# EAGLE design S2Mn10 (EAGLE 7.5.0)
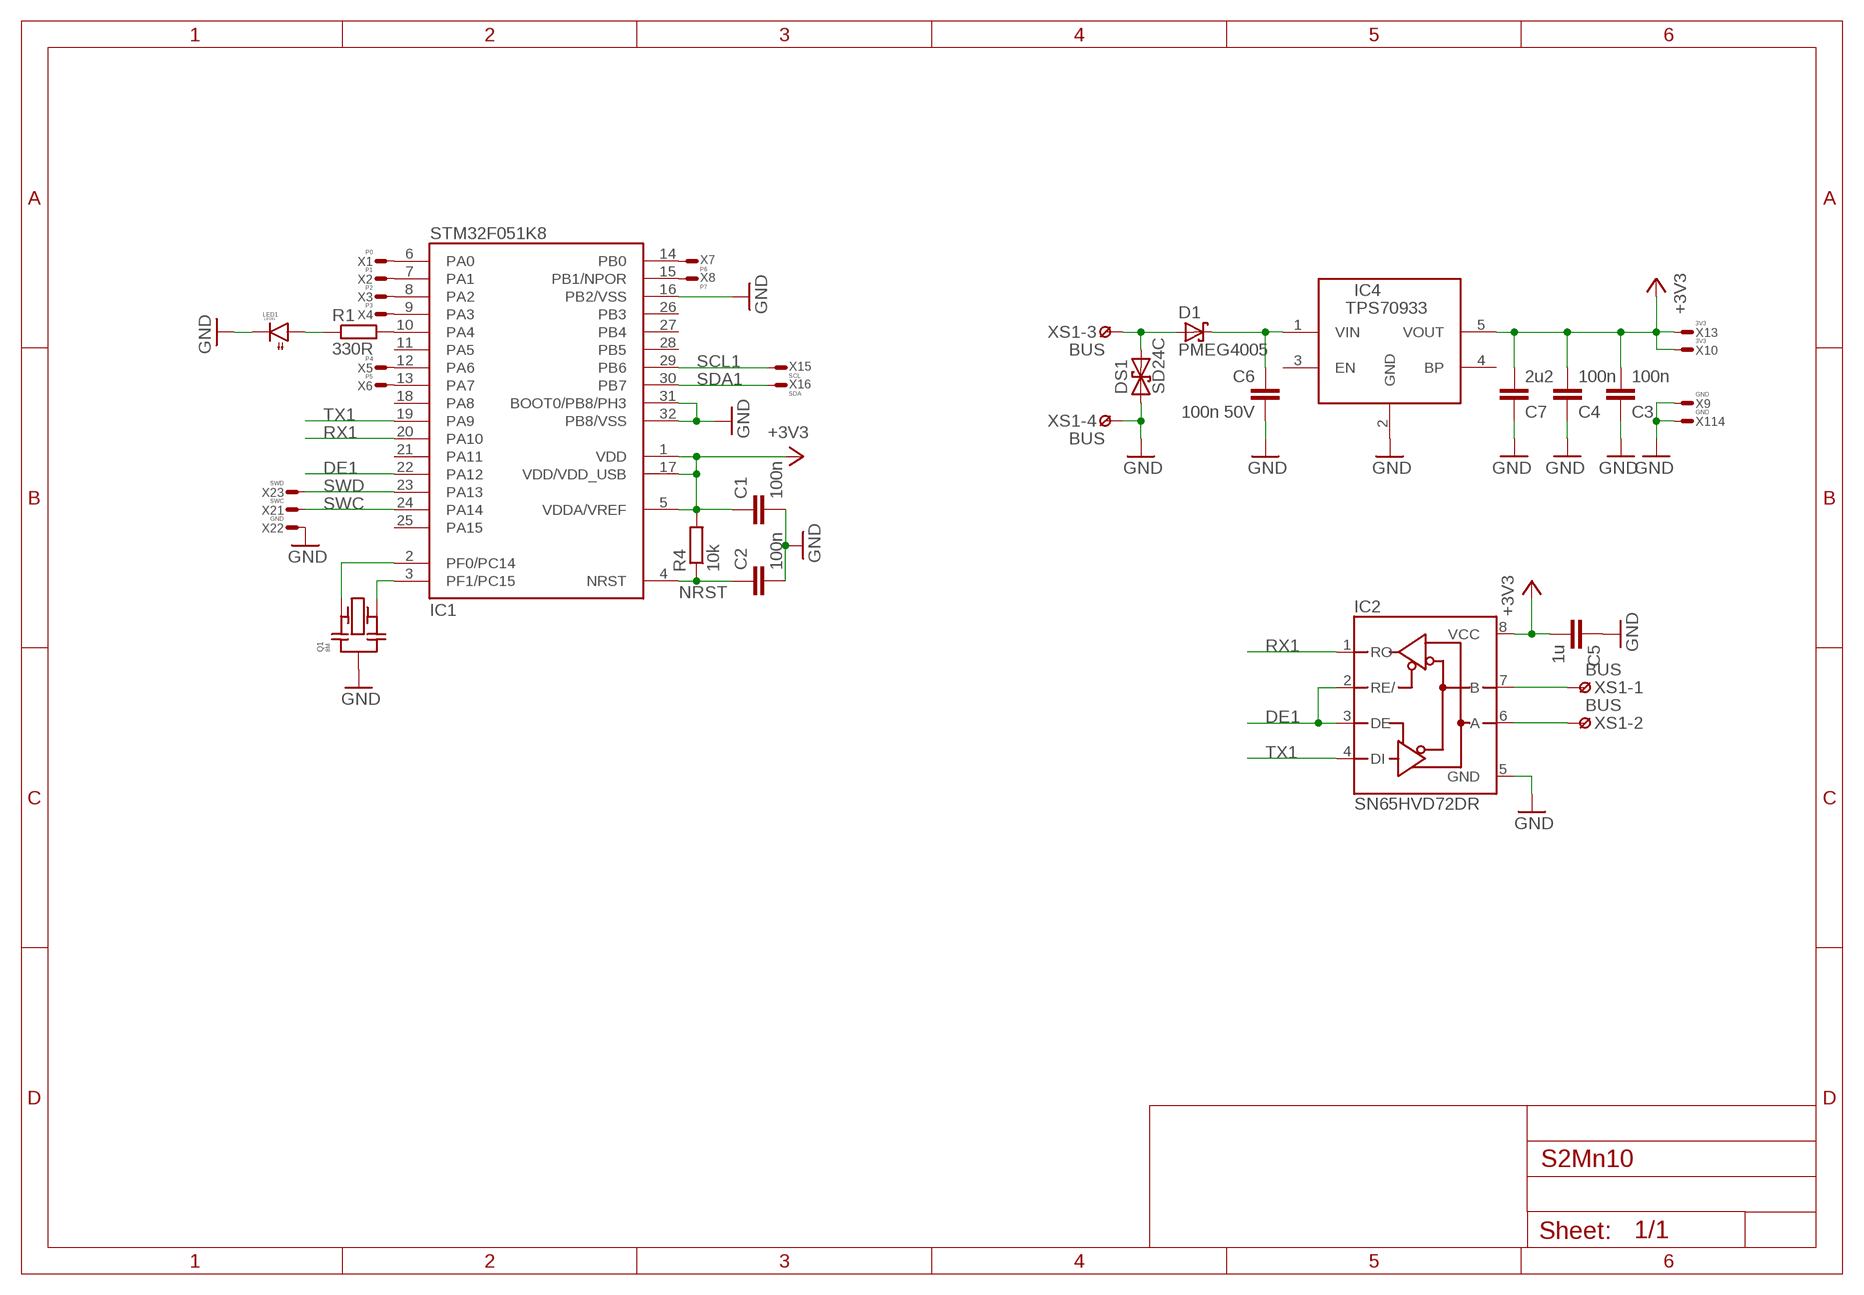
[diagram p0: schematic, sheet 1]

## Parts
C1  100n  C0603  [0603]
C2  100n  C0603  [0603]
C3  100n  C0603  [0603]
C4  100n  C0603  [0603]
C5  1u  C0603  [0603]
C6  100n 50V  C0603  [0603]
C7  2u2  C0603  [0603]
D1  PMEG4005  D-SCHOTKY323  [SOD323]
DS1  SD24C  TVS-U323  [SOD323]
IC1  STM32F051K8  STM32_LQFP32  [LQFP32-7X7]
IC2  SN65HVD72DR  MAX485  [SOIC8]
IC4  TPS70933  LDO  [SOT23-5]
LED1  LEDG  LED1206  [1206]
Q1  8M  QRCE  [CSTCE]
R1  330R  R0603  [0603]
R4  10k  R0603  [0603]
X1  P0  WIREPADT1.6/0.9  [T1.6/0.9]
X2  P1  WIREPADT1.6/0.9  [T1.6/0.9]
X3  P2  WIREPADT1.6/0.9  [T1.6/0.9]
X4  P3  WIREPADT1.6/0.9  [T1.6/0.9]
X5  P4  WIREPADT1.6/0.9  [T1.6/0.9]
X6  P5  WIREPADT1.6/0.9  [T1.6/0.9]
X7  P6  WIREPADT1.6/0.9  [T1.6/0.9]
X8  P7  WIREPADT1.6/0.9  [T1.6/0.9]
X9  GND  WIREPADT1.6/0.9  [T1.6/0.9]
X10  3V3  WIREPADT1.6/0.9  [T1.6/0.9]
X13  3V3  WIREPADT1.6/0.9  [T1.6/0.9]
X15  SCL  WIREPADT1.6/0.9  [T1.6/0.9]
X16  SDA  WIREPADT1.6/0.9  [T1.6/0.9]
X21  SWC  WIREPADT1.6/0.9  [T1.6/0.9]
X22  GND  WIREPADT1.6/0.9  [T1.6/0.9]
X23  SWD  WIREPADT1.6/0.9  [T1.6/0.9]
X114  GND  WIREPADT1.6/0.9  [T1.6/0.9]
XS1  BUS  1725672  [1725672]

## Nets
+3V3: C1.1 C3.2 C4.2 C5.2 C7.2 IC1.1(VDD) IC1.5(VDDA/VREF) IC1.17(VDD/VDD_USB) IC2.8(VCC) IC4.5(VOUT) R4.2 X10.1(S) X13.1(S)
DE1: IC1.22(PA12) IC2.2(RE/) IC2.3(DE)
GND: C1.2 C2.2 C3.1 C4.1 C5.1 C6.2 C7.1 DS1.A IC1.16(PB2/VSS) IC1.31(BOOT0/PB8/PH3) IC1.32(PB8/VSS) IC2.5(GND) IC4.2(GND) LED1.2(C) Q1.G(M) X9.1(S) X22.1(S) X114.1(S) XS1.4
LED: IC1.10(PA4) R1.2
N$1: IC2.6(A) XS1.2
N$2: IC1.3(PF1/PC15) Q1.B
N$3: IC2.7(B) XS1.1
N$4: IC1.6(PA0) X1.1(S)
N$5: IC1.2(PF0/PC14) Q1.A
N$6: IC1.7(PA1) X2.1(S)
N$7: IC1.8(PA2) X3.1(S)
N$8: IC1.9(PA3) X4.1(S)
N$9: IC1.12(PA6) X5.1(S)
N$10: IC1.13(PA7) X6.1(S)
N$11: IC1.14(PB0) X7.1(S)
N$12: IC1.15(PB1/NPOR) X8.1(S)
N$13: D1.A DS1.C XS1.3
N$14: LED1.1(A) R1.1
N$15: C6.1 D1.C IC4.1(VIN)
NRST: C2.1 IC1.4(NRST) R4.1
RX1: IC1.20(PA10) IC2.1(RO)
SCL1: IC1.29(PB6) X15.1(S)
SDA1: IC1.30(PB7) X16.1(S)
SWC: IC1.24(PA14) X21.1(S)
SWD: IC1.23(PA13) X23.1(S)
TX1: IC1.19(PA9) IC2.4(DI)
Unconnected: IC1.11(PA5) IC1.18(PA8) IC1.21(PA11) IC1.25(PA15) IC1.26(PB3) IC1.27(PB4) IC1.28(PB5) IC4.3(EN) IC4.4(BP)

## Library data of the parts
C1-C7 = RCL:C: Capacitor SMD
D1 = Diode:D-SCHOTKY: Schottky Diode
DS1 = Diode:TVS-U: DIODE
IC1 = STM32:STM32_LQFP32
IC2 = ICs:MAX485
IC4 = DCDC:LDO
LED1 = Optic:LED
Q1 = QUARTZ:QR
R1 R4 = RCL:R: Resistor SMD
X1-X10 X13 X15 X16 X21-X23 X114 = Conn:WIREPAD: Wire PAD connect wire on PCB
XS1 = Conn:1725672

## Board
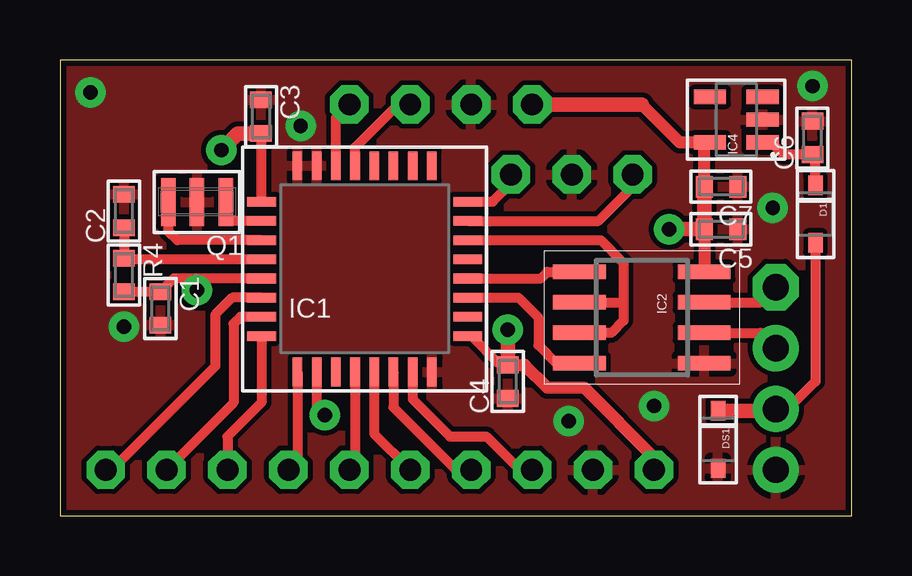
[diagram p1: board, top side]
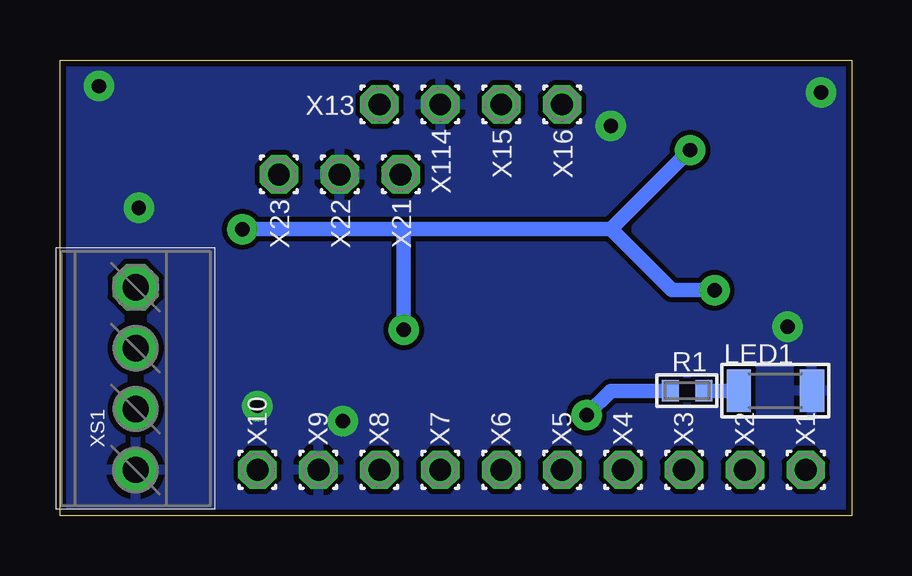
[diagram p2: board, bottom side, seen from below]

Size 33 x 19 mm. Coordinates in mm from the lower left corner, seen from the top.
Outline: 0,0 33,0 33,19 0,19 0,0
Copper layers (1*16): Top 0.035mm / dielectric 1.5mm / Bottom 0.035mm
Design rules "default *": minimum track width 10mil, minimum drill 12mil, track to track 8mil, track to pad 8mil, pad to pad 8mil, via to via 8mil, smd to smd 8mil, copper to edge 10mil, drill to drill 8mil, minimum pad ring 10mil, minimum via ring 8mil, stop-mask expansion 2mil, vias tented up to drill 0mil, thermal gap 10mil

### Footprints (pad centres in the part's own frame; a part is rotated, then mirrored left to right if it is on the bottom)
0603 = smd 0.7 x 0.9: 1 -0.697,0; 2 0.697,0
SOD323 = smd 0.8 x 0.6: A 1.2,0; C -1.2,0
LQFP32-7X7 = smd 1.2 x 0.4: 1 -4.3,2.8; 2 -4.3,2; 3 -4.3,1.2; 4 -4.3,0.4; 5 -4.3,-0.4; 6 -4.3,-1.2; 7 -4.3,-2; 8 -4.3,-2.8; 17 4.3,-2.8; 18 4.3,-2; 19 4.3,-1.2; 20 4.3,-0.4; 21 4.3,0.4; 22 4.3,1.2; 23 4.3,2; 24 4.3,2.8 | smd 0.4 x 1.2: 9 -2.8,-4.3; 10 -2,-4.3; 11 -1.2,-4.3; 12 -0.4,-4.3; 13 0.4,-4.3; 14 1.2,-4.3; 15 2,-4.3; 16 2.8,-4.3; 25 2.8,4.3; 26 2,4.3; 27 1.2,4.3; 28 0.4,4.3; 29 -0.4,4.3; 30 -1.2,4.3; 31 -2,4.3; 32 -2.8,4.3
SOIC8 = smd 0.6 x 2.2: 1 -1.905,-2.6; 2 -0.635,-2.6; 3 0.635,-2.6; 4 1.905,-2.6; 5 1.905,2.6; 6 0.635,2.6; 7 -0.635,2.6; 8 -1.905,2.6
SOT23-5 = smd 0.6 x 1.35: 1 -0.95,-1.101; 2 0,-1.101; 3 0.95,-1.101; 4 0.95,1.101; 5 -0.951,1.101
1206 = smd 1.016 x 1.778: 1 -1.524,0; 2 1.524,0
CSTCE = smd 0.6 x 2: A -1.2,0; B 1.2,0; G 0,0
T1.6/0.9 = drill 0.914 pad 1.6 octagon: 1 0,0
1725672 = drill 1.1 pad 1.93 octagon: 1 -3.81,0 | drill 1.1 pad 1.93: 2 -1.27,0; 3 1.27,0; 4 3.81,0

### Placement (x,y rotation side)
C1  4.19,8.64 270 top
C2  2.67,12.7 90 top
C3  8.38,16.64 270 top
C4  18.67,5.59 90 top
C5  27.56,11.94 180 top
C6  31.37,15.75 90 top
C7  27.56,13.72 180 top
D1  31.5,12.57 270 top
DS1  27.43,3.17 270 top
IC1  12.7,10.29 0 top
IC2  24.26,8.26 270 top
IC4  28.19,16.51 90 top
LED1  3.17,5.21 0 bottom
Q1  5.71,13.08 180 top
R1  6.86,5.21 180 bottom
R4  2.67,10.03 270 top
X1  1.91,1.91 90 bottom
X2  4.45,1.91 90 bottom
X3  6.99,1.91 90 bottom
X4  9.53,1.91 90 bottom
X5  12.06,1.91 90 bottom
X6  14.61,1.91 90 bottom
X7  17.14,1.91 90 bottom
X8  19.68,1.91 90 bottom
X9  22.23,1.91 90 bottom
X10  24.77,1.91 90 bottom
X13  19.68,17.14 180 bottom
X15  14.61,17.14 270 bottom
X16  12.06,17.14 270 bottom
X21  18.8,14.22 270 bottom
X22  21.34,14.22 270 bottom
X23  23.88,14.22 270 bottom
X114  17.14,17.14 270 bottom
XS1  29.84,5.71 270 bottom

### Tracks (layer width: path | path; a pad name or v marks a point on that pad's centre or on a via)
+3V3  (via drill 0.6 pad 1.27)
  Top 0.406: IC1.1 8.4,15.92 C3.2 | IC1.5 5.71,9.89 | 5.71,9.89 4.75,9.89 C1.1 R4.2 | v5.71,9.4 5.71,9.89 | IC1.17 17.15,7.49 18.29,6.35 18.6,6.35 C4.2
  Top 0.508: 24.26,17.14 25.84,15.56 IC4.5 26.86,15.56 C7.2 | C5.2 IC2.8 | C4.2 19.37,6.29 20.32,5.33 21.84,5.33 24.77,2.41
  Top 0.61: v25.4,11.94 C5.2 C7.2 | 8.4,15.92 7.41,15.92 v6.73,15.24 | C4.2 v18.67,7.75 | 24.26,17.14 X13.1 | X10.1 24.77,2.41
  Bottom 0.61: v25.4,11.94 18.67,11.94 | 18.67,11.94 10.03,11.94 | 10.03,11.94 v6.73,15.24 | 10.03,11.94 7.49,9.4 v5.71,9.4 | v18.67,7.75 18.67,11.94
DE1
  Top 0.406: IC2.3 22.99,7.62 23.5,8.13 23.5,8.89 | 23.5,8.89 23.5,10.54 22.55,11.49 IC1.22 | IC2.2 23.5,8.89
GND  (via drill 0.6 pad 1.27)
  other vias: 21.21,3.94 29.72,12.83 24.77,4.57 31.37,17.91 10.03,16.26 2.67,7.87 1.27,17.65
  pour Top: 0,0 33,0 33,19 0,19
  pour Bottom: 0,0 33,0 33,19 0,19
LED  (via drill 0.6 pad 1.27)
  Top 0.406: IC1.10 10.7,4.54 v11.05,4.19
  Bottom 0.61: R1.2 10.03,5.21 v11.05,4.19
N$1
  Top 0.406: IC2.6 29.21,7.62 XS1.2
N$2
  Top 0.406: IC1.3 4.9,11.49 4.51,11.87 Q1.B
N$3
  Top 0.406: IC2.7 29.21,8.89 XS1.1
N$4
  Top 0.406: IC1.6 7.18,9.09 6.48,8.38 6.48,6.22 2.16,1.91 X1.1
N$5
  Top 0.406: IC1.2 6.92,12.29 Q1.A
N$6
  Top 0.406: IC1.7 7.53,8.29 7.24,8 7.24,4.7 X2.1
N$7
  Top 0.406: IC1.8 8.4,4.72 6.99,3.3 X3.1
N$8
  Top 0.406: IC1.9 9.9,2.28 X4.1
N$9
  Top 0.406: IC1.12 12.3,2.14 X5.1
N$10
  Top 0.406: IC1.13 13.1,3.41 X6.1
N$11
  Top 0.406: IC1.14 13.9,4.51 16.51,1.91 X7.1
N$12
  Top 0.406: IC1.15 14.7,4.86 16.26,3.3 17.78,3.3 19.18,1.91 X8.1
N$13
  Top 0.406: D1.A 31.5,5.59 30.35,4.45 XS1.3
  Top 0.61: DS1.C 29.77,4.38 XS1.3
N$14
  Bottom 0.61: R1.1 LED1.1
N$15
  Top 0.406: IC4.1 29.65,15.56 30.16,15.05 C6.1 31.5,14.92 D1.C
NRST
  Top 0.406: IC1.4 2.71,10.69 R4.1 C2.1
RX1
  Top 0.406: IC2.1 20.32,10.16 20.05,9.89 IC1.20
SCL1
  Top 0.406: IC1.29 12.3,15.35 14.1,17.14 X15.1
SDA1
  Top 0.406: IC1.30 11.5,16.58 X16.1
SWC
  Top 0.406: IC1.24 18.04,13.09 18.8,13.84 X21.1
SWD
  Top 0.406: IC1.23 22.45,12.29 23.88,13.72 X23.1
TX1
  Top 0.406: IC1.19 19.11,9.09 19.94,8.26 19.94,7.11 20.7,6.35 IC2.4